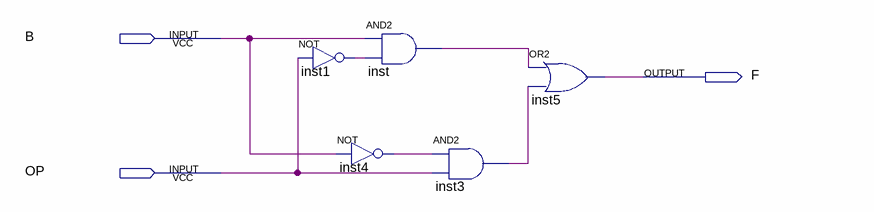
[diagram p0: schematic sheet]
// Quartus schematic OP_signal.bdf as structural Verilog: 5 symbols, 3 pins
module OP_signal (
  input  B,
  input  OP,
  output F
);

  wire inst1_out, inst3_out, inst4_out, inst_out;

  not inst1 (inst1_out, OP);
  not inst4 (inst4_out, B);
  and inst (inst_out, B, inst1_out);
  and inst3 (inst3_out, inst4_out, OP);
  or inst5 (F, inst_out, inst3_out);
endmodule
